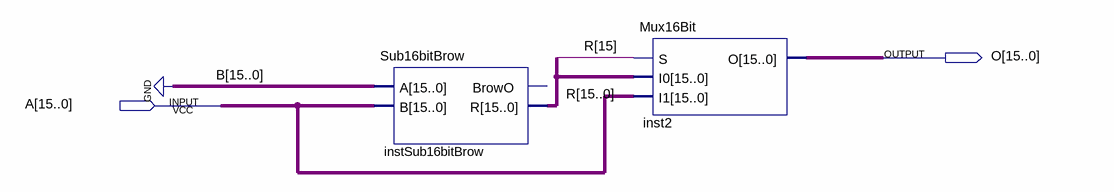
[diagram p0: schematic sheet]
// Quartus schematic Abs.bdf as structural Verilog: 2 symbols, 2 pins
module Abs (
  input  [15:0] A,
  output [15:0] O
);

  wire [15:0] R;

  Sub16bitBrow instSub16bitBrow (.A({16{1'b0}}), .B(A), .R(R));  // open: BrowO
  Mux16Bit inst2 (.S(R[15]), .I0(R), .I1(A), .O(O));
endmodule
